# EAGLE design 301_ble_siliconlabs (EAGLE 9.6.2)
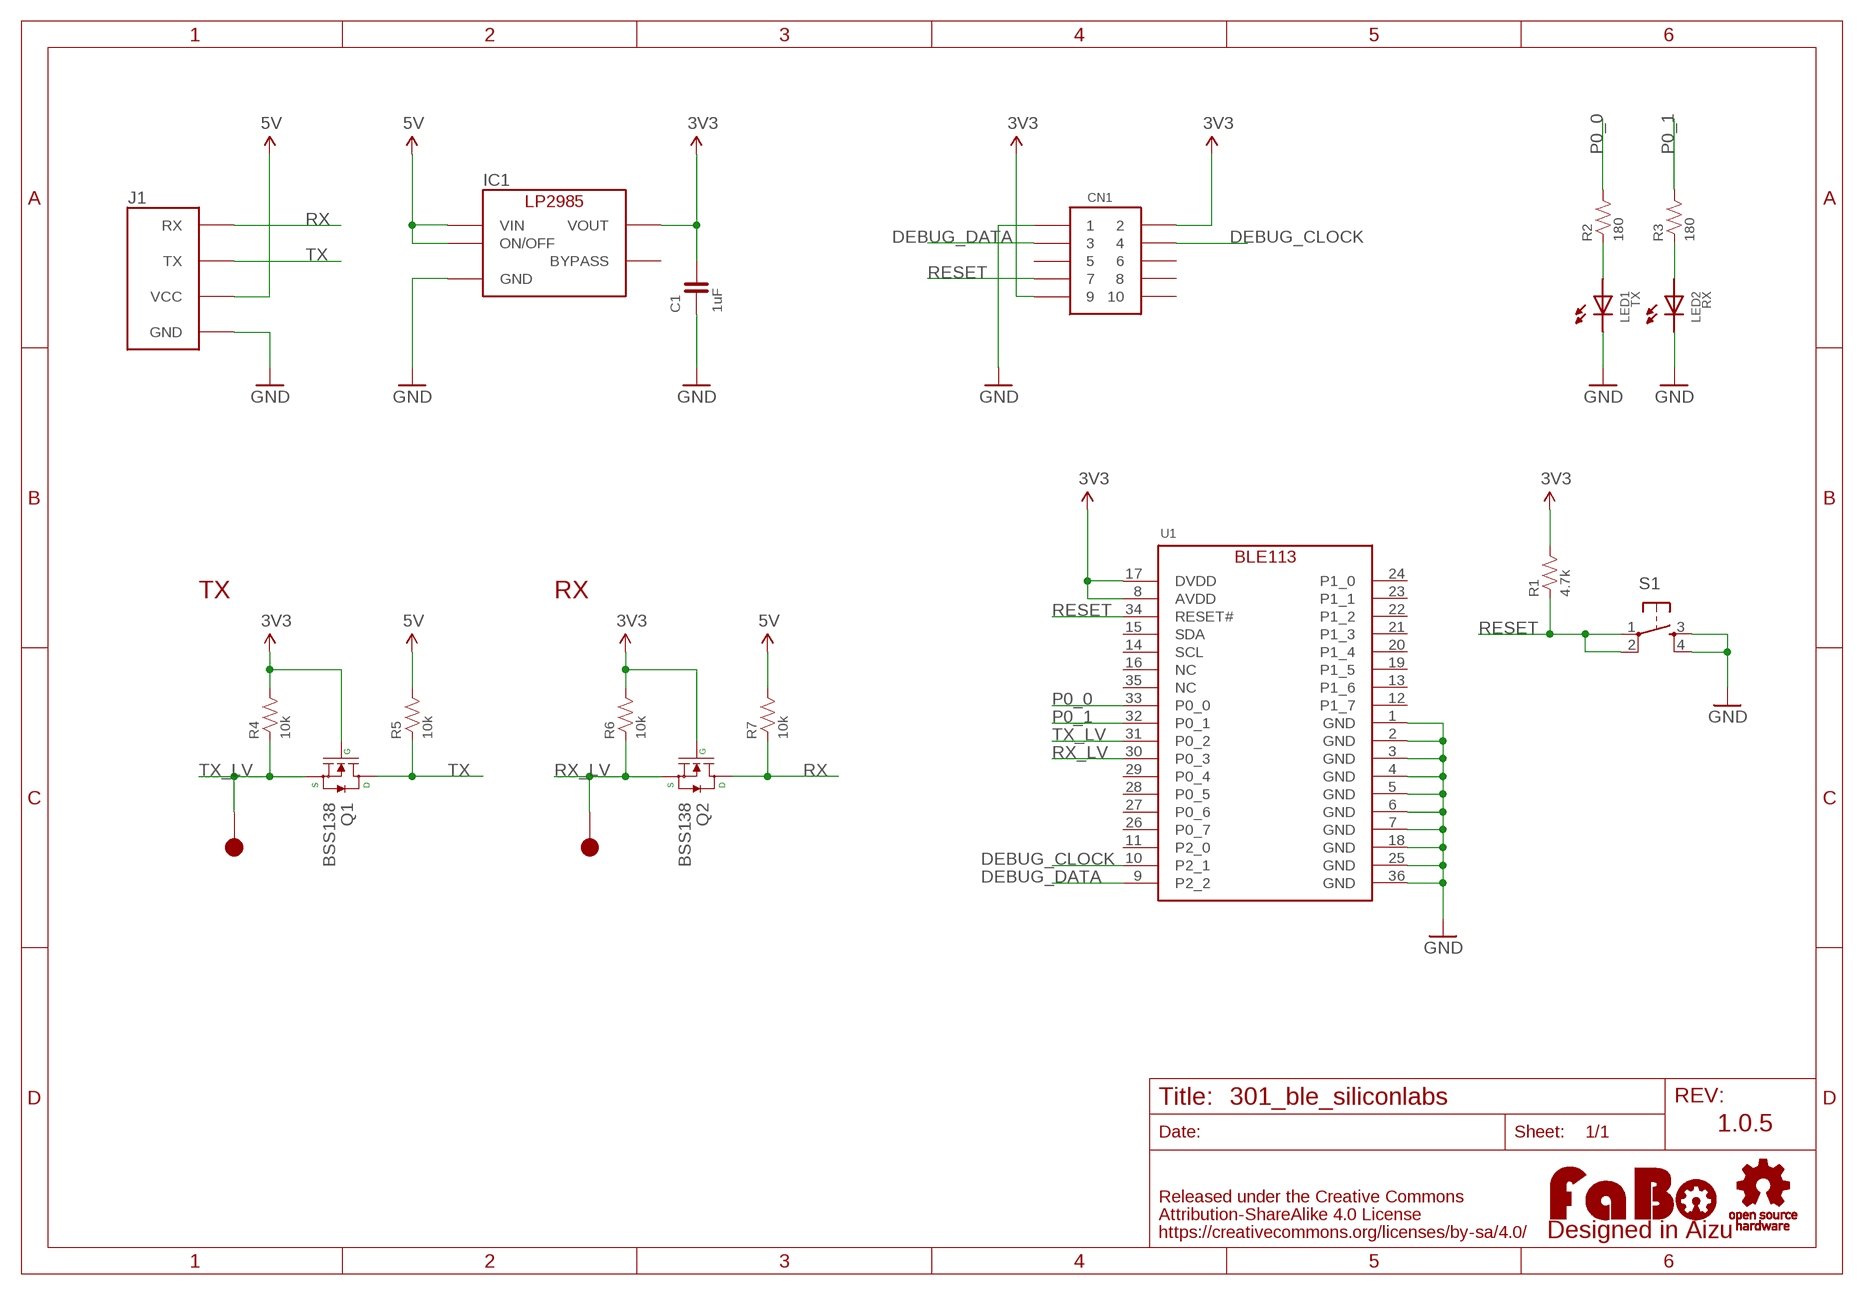
[diagram p0: schematic, sheet 1]

## Parts
C1  1uF  CAPACITOR-0603_NARROW  [0603-NARROW]
CN1  PIN-HEADER-SMT(1.27MM)2X5  [PIN-HEADER-SMT(1.27MM)2X5]
IC1  LP2985-33DBV  [SOT-23-5]
J1  FABO_BRICK_SERIAL  [FABO_BRICK_SERIAL]
LED1  TX  LED-0603  [0603]
LED2  RX  LED-0603  [0603]
LOGO1  LOGO_FABO-M_BOTTOM  [LOGO_FABO_M_BOTTOM]
Q1  BSS138  MOSFET-N-BSS138  [SOT23-3]
Q2  BSS138  MOSFET-N-BSS138  [SOT23-3]
R1  4.7k  RESISTOR-0603-NARROW  [0603-NARROW]
R2  180  RESISTOR-0603  [0603]
R3  180  RESISTOR-0603  [0603]
R4  10k  RESISTOR-0603-NARROW  [0603-NARROW]
R5  10k  RESISTOR-0603-NARROW  [0603-NARROW]
R6  10k  RESISTOR-0603-NARROW  [0603-NARROW]
R7  10k  RESISTOR-0603-NARROW  [0603-NARROW]
S1  TACT-SWITCH-SMD_KMR2  [KMR2]
TP10  TP-15  [TP-15]
TP11  TP-15  [TP-15]
U1  BLUEGIGA-BLE113  [BLUEGIGA-BLE113]
U$2  LOGO_OSHW-M_BOTTOM  [LOGO_OSHW_M_BOTTOM]

## Nets
3V3: C1.2 CN1.2 CN1.9 IC1.5(VOUT) Q1.1(G) Q2.1(G) R1.2 R4.2 R6.2 U1.8(AVDD) U1.17(DVDD)
5V: IC1.1(VIN) IC1.3(ON/OFF) J1.VCC R5.2 R7.2
DEBUG_CLOCK: CN1.4 U1.10(P2_1)
DEBUG_DATA: CN1.3 U1.9(P2_2)
GND: C1.1 CN1.1 IC1.2(GND) J1.GND LED1.CATHODE LED2.CATHODE S1.3 S1.4 U1.1(GND) U1.2(GND) U1.3(GND) U1.4(GND) U1.5(GND) U1.6(GND) U1.7(GND) U1.18(GND) U1.25(GND) U1.36(GND)
N$1: LED1.ANODE R2.1
N$2: LED2.ANODE R3.1
P0_0: R2.2 U1.33(P0_0)
P0_1: R3.2 U1.32(P0_1)
RESET: CN1.7 R1.1 S1.1 S1.2 U1.34(RESET#)
RX: J1.RX Q2.3(D) R7.1
RX_LV: Q2.2(S) R6.1 TP10.1 U1.30(P0_3)
TX: J1.TX Q1.3(D) R5.1
TX_LV: Q1.2(S) R4.1 TP11.1 U1.31(P0_2)
Unconnected: CN1.5 CN1.6 CN1.8 CN1.10 IC1.4(BYPASS) U1.11(P2_0) U1.12(P1_7) U1.13(P1_6) U1.14(SCL) U1.15(SDA) U1.16(NC) U1.19(P1_5) U1.20(P1_4) U1.21(P1_3) U1.22(P1_2) U1.23(P1_1) U1.24(P1_0) U1.26(P0_7) U1.27(P0_6) U1.28(P0_5) U1.29(P0_4) U1.35(NC)

## Notes on the sheet
- TX | RX
- 1.0.5

## Library data of the parts
C1 = FaBo-Capacitor:CAPACITOR: CAPACITOR
CN1 = FaBo-etc:PIN-HEADER-SMT(1.27MM)2X5: PIN-HEADER-SMT (1.27MM) 2x5
IC1 = FaBo-Supply:LP2985: LP2985
J1 = FaBo-Template:FABO_BRICK_SERIAL: FaBo Brick Serial
LED1 LED2 = FaBo-LED:LED
LOGO1 = component:LOGO_FABO
Q1 Q2 = FaBo-etc:MOSFET-N
R1-R7 = FaBo-Resistors:RESISTOR: RESISTOR
S1 = FaBo-Switch:TACT-SWITCH
TP10 TP11 = FaBo-Supply:TP
U1 = FaBo-BT:BLUEGIGA-BLE113: Bluegiga BLE113 Bluetooth Bluetooth 4.0 low energy radio Radio Transmit power: +0 dBm Receiver sensitivity: -93 dBm Typical line-of-sight range: 30 - 100 meters Current Consumption TX peak current: 18.2 mA, 14.3 ma (with DC/DC) RX peak current: 17.9 mA Power mode 1: 270 uA Power mode 2: 1 uA Power mode 3: 0.4 uA Certifications Japan: MIC Japan( 007-AB0103)
U$2 = FaBo-etc:LOGO_OSHW

## Board
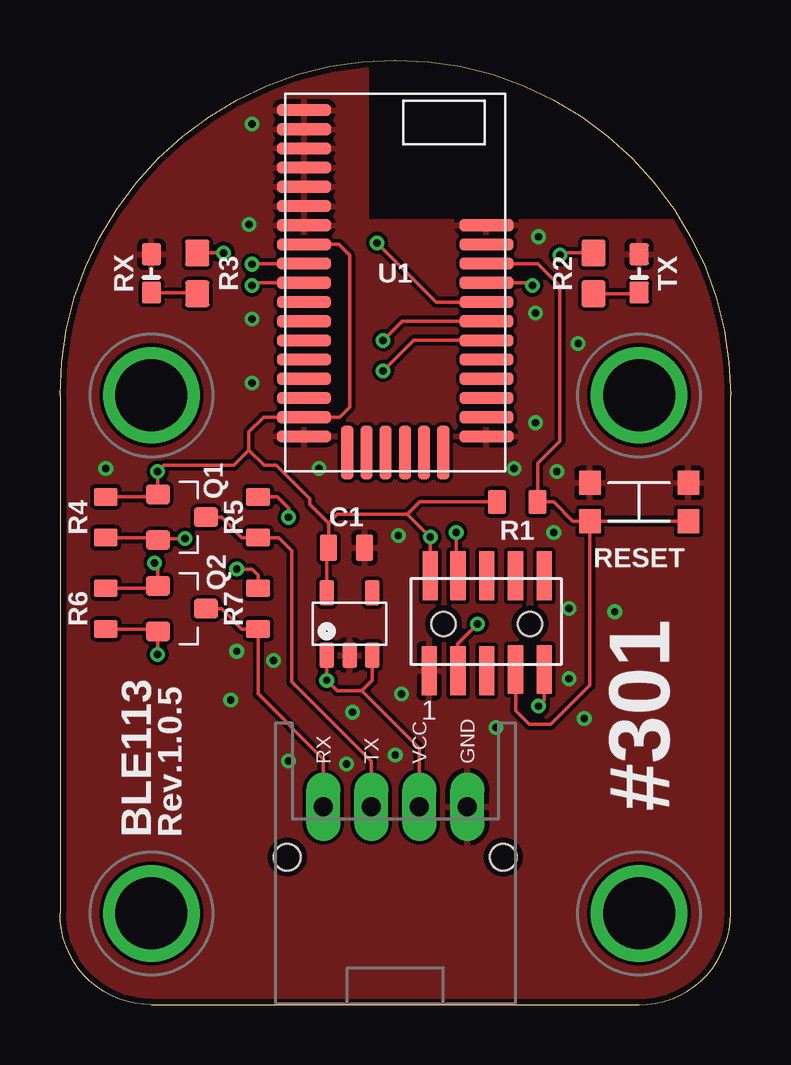
[diagram p1: board, top side]
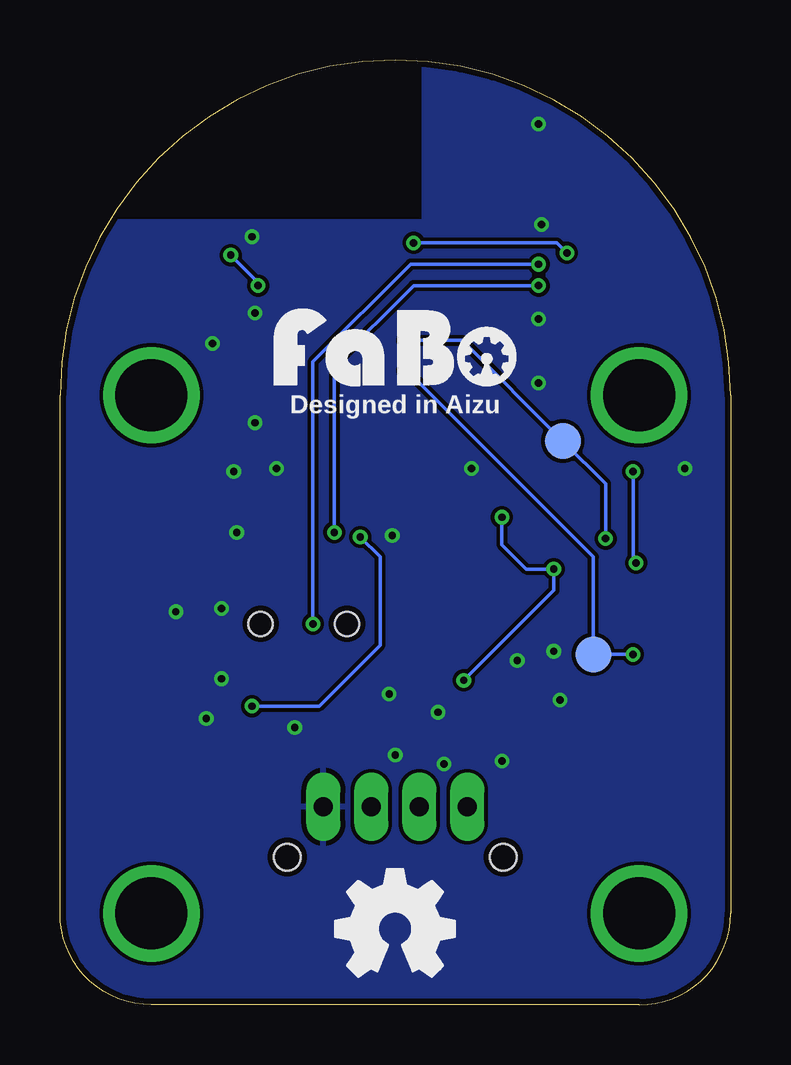
[diagram p2: board, bottom side, seen from below]

Size 27.94 x 39.37 mm. Coordinates in mm from the lower left corner, seen from the top.
Copper layers (1*16): Top 0.035mm / dielectric 1.6mm / Bottom 0.035mm
Design rules "PCBway": minimum track width 6mil, minimum drill 12mil, track to track 6mil, track to pad 6mil, pad to pad 6mil, via to via 6mil, smd to smd 6mil, copper to edge 10mil, drill to drill 10mil, minimum pad ring 10mil, minimum via ring 6mil, stop-mask expansion 2mil, vias tented up to drill 100mil, thermal gap 8mil
tRestrict: area 12.9,32.8 to 27.9,39.4
bRestrict: area 12.9,32.8 to 27.9,39.4

### Footprints (pad centres in the part's own frame; a part is rotated, then mirrored left to right if it is on the bottom)
0603-NARROW = smd 0.71 x 1.09: 1 -0.75,0; 2 0.75,0
PIN-HEADER-SMT(1.27MM)2X5 = smd 0.635 x 2.032: 1 -2.4,-1.95; 2 -2.35,2; 3 -1.2,-1.95; 4 -1.2,2; 5 0,-1.95; 6 0,2; 7 1.2,-1.9; 8 1.2,2; 9 2.4,-1.9; 10 2.4,2 | hole 1: 1.8,0; -1.8,0
SOT-23-5 = smd 0.6 x 1.05: 1 -0.95,-1.3; 2 0,-1.3; 3 0.95,-1.3; 4 0.95,1.3; 5 -0.95,1.3
FABO_BRICK_SERIAL = drill 0.8 pad 1.422 long: GND 3,-10.795; RX -3,-10.795; TX -1,-10.795; VCC 1,-10.795 | drill 3 pad 3.81: P$1 -10.16,6.35; P$2 10.16,6.35; P$3 -10.16,-15.24; P$4 10.16,-15.24 | hole 1.1: -4.5,-12.895; 4.5,-12.895
0603 = smd 0.9 x 0.8: ANODE -0.8,0; CATHODE 0.8,0
SOT23-3 = smd 0.8 x 1: 1 -0.95,-1; 2 0.95,-1; 3 0,1
0603-NARROW' = smd 0.75 x 1: 1 -0.85,0; 2 0.85,0
0603' = smd 1.1 x 1: 1 -0.85,0; 2 0.85,0
KMR2 = smd 0.9 x 1: 1 -2.05,0.8; 2 2.05,0.8; 3 2.05,-0.8; 4 -2.05,-0.8
TP-15 = smd 1.5 x 1.5: 1 0,0
BLUEGIGA-BLE113 = smd 2.25 x 0.5: 1 -3.8,7.188; 2 -3.8,6.388; 3 -3.8,5.588; 4 -3.8,4.787; 5 -3.8,3.987; 6 -3.8,3.188; 7 -3.8,2.388; 8 -3.8,1.587; 9 -3.8,0.787; 10 -3.8,-0.013; 11 -3.8,-0.812; 12 -3.8,-1.613; 13 -3.8,-2.413; 14 -3.8,-3.212; 15 -3.8,-4.013; 16 -3.8,-4.812; 17 -3.8,-5.612; 18 -3.8,-6.412; 25 3.8,-6.412; 26 3.8,-5.612; 27 3.8,-4.812; 28 3.8,-4.013; 29 3.8,-3.212; 30 3.8,-2.413; 31 3.8,-1.613; 32 3.8,-0.812; 33 3.8,-0.013; 34 3.8,0.787; 35 3.8,1.587; 36 3.8,2.388 | smd 0.5 x 2.25: 19 -2,-7.088; 20 -1.2,-7.088; 21 -0.4,-7.088; 22 0.4,-7.088; 23 1.2,-7.088; 24 2,-7.088

### Placement (x,y rotation side)
C1  11.94,19.05 180 top
CN1  17.78,15.88 0 top
IC1  12.06,15.88 0 top
J1  13.97,19.05 0 top
LED1  24.13,30.48 90 top
LED2  3.81,30.48 90 top
LOGO1  13.97,25.4 0 top
Q1  5.08,20.32 270 top
Q2  5.08,16.51 270 top
R1  4.7k  [0603-NARROW']  19.05,20.95 180 top
R2  180  [0603']  22.23,30.48 90 top
R3  180  [0603']  5.71,30.48 90 top
R4  10k  [0603-NARROW']  1.91,20.32 90 top
R5  10k  [0603-NARROW']  8.26,20.32 90 top
R6  10k  [0603-NARROW']  1.91,16.51 90 top
R7  10k  [0603-NARROW']  8.26,16.51 90 top
S1  24.13,20.95 180 top
TP10  5.71,14.61 0 bottom
TP11  6.99,23.5 0 bottom
U1  13.97,30.1 0 top
U$2  13.97,3.17 0 top

### Tracks (layer width: path | path; a pad name or v marks a point on that pad's centre or on a via)
3V3  (via drill 0.3)
  Top 0.152: U1.8 11.62,31.69 12.06,31.24 12.06,24.89 11.66,24.49 U1.17 8.48,24.49 7.87,23.88 7.87,23.11 | 7.87,23.11 8.51,22.48 9.02,22.48 10.41,21.08 10.41,20.85 11.19,20.08 | R1.2 14.99,20.95 14.48,20.45 | 7.87,23.11 7.24,22.48 4.32,22.48 v4.06,22.23 4.06,21.29 Q1.1 3.98,21.17 R4.2 | 11.19,20.08 C1.2 11.12,18.98 IC1.5 | 11.19,20.08 11.56,20.45 14.48,20.45 | CN1.2 v15.43,19.5 14.48,20.45 | R6.2 3.98,17.36 Q2.1 4.08,18.27 v3.94,18.41 | CN1.9 20.18,12.69 v19.94,12.45
  Bottom 0.152: v3.94,18.41 4.06,18.54 v4.06,22.23 | v19.94,12.45 17.14,12.45 14.61,14.99 14.61,18.67 v15.43,19.5
5V  (via drill 0.3)
  Top 0.152: IC1.1 v11.12,13.52 11.56,13.08 12.57,13.08 | IC1.3 13.02,13.52 12.57,13.08 | J1.VCC 14.97,10.68 12.57,13.08 | R7.2 8.26,17.91 8,18.16 v7.37,18.16 | R5.2 9.06,21.17 9.53,20.7 v9.53,20.32
  Bottom 0.152: v11.12,13.52 7.37,17.27 v7.37,18.16 8.51,18.16 9.53,19.18 v9.53,20.32
DEBUG_CLOCK  (via drill 0.3)
  Top 0.152: U1.10 8.12,30.09 v8,29.97 | v16.51,19.68 16.51,17.95 CN1.4
  Bottom 0.152: v8,29.97 13.21,29.97 16.51,26.67 v16.51,19.68
DEBUG_DATA  (via drill 0.3)
  Top 0.152: U1.9 8.03,30.89 v8,30.86 | 16.64,13.87 CN1.3 16.58,15.06 v17.4,15.88
  Bottom 0.152: v8,30.86 13.34,30.86 17.4,26.8 v17.4,15.88
GND  (via drill 0.3)
  other vias: 19.94,32 7.87,32.51 8,36.7 8,28.57 8,25.91 19.81,28.83 19.81,24.26 18.92,22.35 20.7,22.23 21.59,27.56 10.79,22.35 1.91,22.35 14.1,19.56 20.57,19.68 23.11,16.38 21.21,16.51 21.21,13.59 21.84,11.94 18.16,11.56 14.22,12.95 13.97,10.41 11.94,10.03 12.19,12.19 8.89,14.35 7.37,14.73 7.11,12.7 9.53,10.16
  pour Top: 0,0 27.94,0 27.94,39.37 0,39.37
  pour Bottom: 0,0 27.94,0 27.94,39.37 0,39.37
N$1
  Top 0.152: LED1.ANODE 24.08,29.63 R2.1
N$2
  Top 0.152: LED2.ANODE 5.67,29.68 R3.1
P0_0  (via drill 0.3)
  Top 0.152: U1.33 19.57,30.09 v19.68,29.97 | 20.95,31.37 v20.83,31.24 20.92,31.33 R2.2
  Bottom 0.152: v19.68,29.97 19.68,30.1 v20.83,31.24
P0_1  (via drill 0.3)
  Top 0.152: U1.32 15.67,29.29 v13.21,31.75 | R3.2 v6.82,31.33
  Bottom 0.152: v13.21,31.75 7.24,31.75 v6.82,31.33
RESET
  Top 0.152: CN1.7 18.98,12.26 19.56,11.68 20.45,11.68 22.08,13.32 S1.2 | S1.1 S1.2 | S1.2 21.37,20.16 20.57,20.95 R1.1 19.9,22.57 20.83,23.5 20.83,29.97 19.91,30.89 U1.34
RX
  Top 0.152: J1.RX 10.97,10.24 8.26,12.95 R7.1 7.58,15.66 6.73,16.51 Q2.3
RX_LV  (via drill 0.3)
  Top 0.152: R6.1 3.98,15.66 Q2.2 4.06,15.54 v4.06,14.61 | U1.30 14.73,27.69 v13.46,26.42
  Bottom 0.152: v13.46,26.42 5.71,18.67 TP10.1 v4.06,14.61
TX
  Top 0.152: J1.TX 12.97,10.14 9.65,13.46 9.65,18.92 9.11,19.47 R5.1 7.58,19.47 6.73,20.32 Q1.3
TX_LV  (via drill 0.3)
  Top 0.152: R4.1 3.98,19.47 Q1.2 4.14,19.43 v5.21,19.43 | U1.31 14.26,28.49 v13.46,27.69
  Bottom 0.152: v13.46,27.69 11.18,27.69 TP11.1 5.21,21.72 v5.21,19.43

### Text on the board
tPlace: RX | TX | RESET | #301 | BLE113 | Rev.1.0.5
bPlace: Designed in Aizu